# Altium schematic sheet Motorisation.SchDoc
size A4; Author: Audran; CompanyName: Goldorak; Address1: Electrolab; Address2: 52 rue Paul Lescop; Address3: 92000 Nanterre; DocumentNumber: 8; SheetNumber: 8; SheetTotal: 8; ProjectName: Cartes_2017
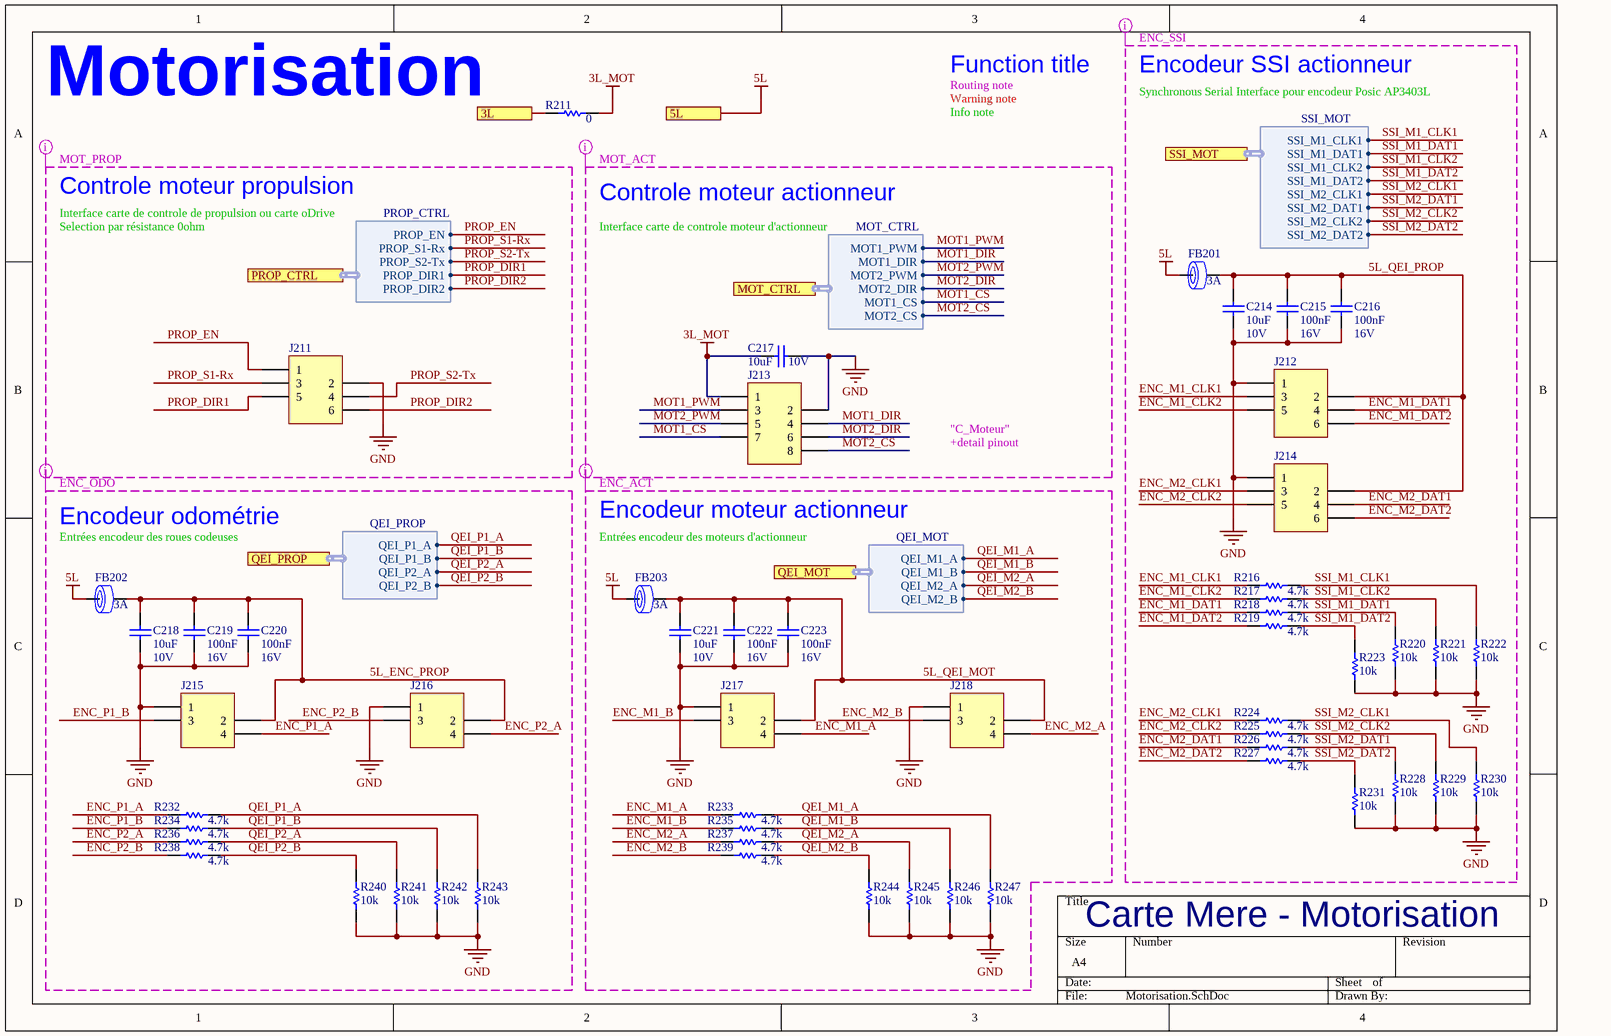
[diagram p0: Motorisation.SchDoc]

## Parts
C214  10uF  RatedVoltage: 10V  [WCAP-CSGP_0805, 2x1.25x1.25]
C215  100nF  RatedVoltage: 16V  [WCAP-CSGP_0402, 1x0.5x0.5]
C216  100nF  RatedVoltage: 16V  [WCAP-CSGP_0402, 1x0.5x0.5]
C217  10uF  RatedVoltage: 10V  [WCAP-CSGP_0805, 2x1.25x1.25]
C218  10uF  RatedVoltage: 10V  [WCAP-CSGP_0805, 2x1.25x1.25]
C219  100nF  RatedVoltage: 16V  [WCAP-CSGP_0402, 1x0.5x0.5]
C220  100nF  RatedVoltage: 16V  [WCAP-CSGP_0402, 1x0.5x0.5]
C221  10uF  RatedVoltage: 10V  [WCAP-CSGP_0805, 2x1.25x1.25]
C222  100nF  RatedVoltage: 16V  [WCAP-CSGP_0402, 1x0.5x0.5]
C223  100nF  RatedVoltage: 16V  [WCAP-CSGP_0402, 1x0.5x0.5]
FB201  RatedCurrent: 3A  [WE-CBF_0805_High Current]  (hidden comment: 742792023)
FB202  RatedCurrent: 3A  [WE-CBF_0805_High Current]  (hidden comment: 742792023)
FB203  RatedCurrent: 3A  [WE-CBF_0805_High Current]  (hidden comment: 742792023)
J211  690367280676  [690367280676]  (value not drawn)
J212  690367280676  [690367280676]  (value not drawn)
J213  690367280876  [690367280876]  (value not drawn)
J214  690367280676  [690367280676]  (value not drawn)
J215  690367280476  [690367280476]  (value not drawn)
J216  690367280476  [690367280476]  (value not drawn)
J217  690367280476  [690367280476]  (value not drawn)
J218  690367280476  [690367280476]  (value not drawn)
R211  value 0  [RESC1608X06N]  (hidden comment: RC0603FR-070RL)
R216  value 4.7k  [RESC1005X04N]  (hidden comment: RC0402FR-074K7L)
R217  value 4.7k  [RESC1005X04N]  (hidden comment: RC0402FR-074K7L)
R218  value 4.7k  [RESC1005X04N]  (hidden comment: RC0402FR-074K7L)
R219  value 4.7k  [RESC1005X04N]  (hidden comment: RC0402FR-074K7L)
R220  value 10k  [RESC1005X04N]  (hidden comment: RC0402FR-0710KL)
R221  value 10k  [RESC1005X04N]  (hidden comment: RC0402FR-0710KL)
R222  value 10k  [RESC1005X04N]  (hidden comment: RC0402FR-0710KL)
R223  value 10k  [RESC1005X04N]  (hidden comment: RC0402FR-0710KL)
R224  value 4.7k  [RESC1005X04N]  (hidden comment: RC0402FR-074K7L)
R225  value 4.7k  [RESC1005X04N]  (hidden comment: RC0402FR-074K7L)
R226  value 4.7k  [RESC1005X04N]  (hidden comment: RC0402FR-074K7L)
R227  value 4.7k  [RESC1005X04N]  (hidden comment: RC0402FR-074K7L)
R228  value 10k  [RESC1005X04N]  (hidden comment: RC0402FR-0710KL)
R229  value 10k  [RESC1005X04N]  (hidden comment: RC0402FR-0710KL)
R230  value 10k  [RESC1005X04N]  (hidden comment: RC0402FR-0710KL)
R231  value 10k  [RESC1005X04N]  (hidden comment: RC0402FR-0710KL)
R232  value 4.7k  [RESC1005X04N]  (hidden comment: RC0402FR-074K7L)
R233  value 4.7k  [RESC1005X04N]  (hidden comment: RC0402FR-074K7L)
R234  value 4.7k  [RESC1005X04N]  (hidden comment: RC0402FR-074K7L)
R235  value 4.7k  [RESC1005X04N]  (hidden comment: RC0402FR-074K7L)
R236  value 4.7k  [RESC1005X04N]  (hidden comment: RC0402FR-074K7L)
R237  value 4.7k  [RESC1005X04N]  (hidden comment: RC0402FR-074K7L)
R238  value 4.7k  [RESC1005X04N]  (hidden comment: RC0402FR-074K7L)
R239  value 4.7k  [RESC1005X04N]  (hidden comment: RC0402FR-074K7L)
R240  value 10k  [RESC1005X04N]  (hidden comment: RC0402FR-0710KL)
R241  value 10k  [RESC1005X04N]  (hidden comment: RC0402FR-0710KL)
R242  value 10k  [RESC1005X04N]  (hidden comment: RC0402FR-0710KL)
R243  value 10k  [RESC1005X04N]  (hidden comment: RC0402FR-0710KL)
R244  value 10k  [RESC1005X04N]  (hidden comment: RC0402FR-0710KL)
R245  value 10k  [RESC1005X04N]  (hidden comment: RC0402FR-0710KL)
R246  value 10k  [RESC1005X04N]  (hidden comment: RC0402FR-0710KL)
R247  value 10k  [RESC1005X04N]  (hidden comment: RC0402FR-0710KL)

## Ports
3L, 5L, MOT_CTRL (harness MOT_CTRL), PROP_CTRL (harness PROP_CTRL), QEI_MOT (harness QEI_MOT), QEI_PROP (harness QEI_PROP), SSI_MOT (harness SSI_MOT)

## Harnesses
PROP_CTRL: PROP_EN, PROP_S1-Rx, PROP_S2-Tx, PROP_DIR1, PROP_DIR2
QEI_PROP: QEI_P1_A, QEI_P1_B, QEI_P2_A, QEI_P2_B
QEI_MOT: QEI_M1_A, QEI_M1_B, QEI_M2_A, QEI_M2_B
SSI_MOT: SSI_M1_CLK1, SSI_M1_DAT1, SSI_M1_CLK2, SSI_M1_DAT2, SSI_M2_CLK1, SSI_M2_DAT1, SSI_M2_CLK2, SSI_M2_DAT2
MOT_CTRL: MOT1_PWM, MOT1_DIR, MOT2_PWM, MOT2_DIR, MOT1_CS, MOT2_CS

## Nets
3L_MOT: C217.1 J213.1 R211.2
5L: FB201.1 FB202.1 FB203.1 ; port 5L
GND: C214.2 C215.2 C216.2 C217.2 C218.2 C219.2 C220.2 C221.2 C222.2 C223.2 J211.2 J212.1 J213.2 J214.1 J215.1 J216.1 J217.1 J218.1 R220.1 R221.1 R222.1 R223.1 R228.1 R229.1 R230.1 R231.1 R240.1 R241.1 R242.1 R243.1 R244.1 R245.1 R246.1 R247.1
3L: R211.1 ; port 3L
5L_ENC_PROP: C218.1 C219.1 C220.1 FB202.2 J215.2 J216.2
5L_QEI_MOT: C221.1 C222.1 C223.1 FB203.2 J217.2 J218.2
5L_QEI_PROP: C214.1 C215.1 C216.1 FB201.2 J212.2 J214.2
ENC_M1_A: J217.4 R233.1
ENC_M1_B: J217.3 R235.1
ENC_M1_CLK1: J212.3 R216.1
ENC_M1_CLK2: J212.5 R217.1
ENC_M1_DAT1: J212.4 R218.1
ENC_M1_DAT2: J212.6 R219.1
ENC_M2_A: J218.4 R237.1
ENC_M2_B: J218.3 R239.1
ENC_M2_CLK1: J214.3 R224.1
ENC_M2_CLK2: J214.5 R225.1
ENC_M2_DAT1: J214.4 R226.1
ENC_M2_DAT2: J214.6 R227.1
ENC_P1_A: J215.4 R232.1
ENC_P1_B: J215.3 R234.1
ENC_P2_A: J216.4 R236.1
ENC_P2_B: J216.3 R238.1
MOT1_CS: J213.7 ; port MOT_CTRL.MOT1_CS
MOT1_DIR: J213.4 ; port MOT_CTRL.MOT1_DIR
MOT1_PWM: J213.3 ; port MOT_CTRL.MOT1_PWM
MOT2_CS: J213.8 ; port MOT_CTRL.MOT2_CS
MOT2_DIR: J213.6 ; port MOT_CTRL.MOT2_DIR
MOT2_PWM: J213.5 ; port MOT_CTRL.MOT2_PWM
PROP_DIR1: J211.5 ; port PROP_CTRL.PROP_DIR1
PROP_DIR2: J211.6 ; port PROP_CTRL.PROP_DIR2
PROP_EN: J211.1 ; port PROP_CTRL.PROP_EN
PROP_S1-Rx: J211.3 ; port PROP_CTRL.PROP_S1-Rx
PROP_S2-Tx: J211.4 ; port PROP_CTRL.PROP_S2-Tx
QEI_M1_A: R233.2 R247.2 ; port QEI_MOT.QEI_M1_A
QEI_M1_B: R235.2 R246.2 ; port QEI_MOT.QEI_M1_B
QEI_M2_A: R237.2 R245.2 ; port QEI_MOT.QEI_M2_A
QEI_M2_B: R239.2 R244.2 ; port QEI_MOT.QEI_M2_B
QEI_P1_A: R232.2 R243.2 ; port QEI_PROP.QEI_P1_A
QEI_P1_B: R234.2 R242.2 ; port QEI_PROP.QEI_P1_B
QEI_P2_A: R236.2 R241.2 ; port QEI_PROP.QEI_P2_A
QEI_P2_B: R238.2 R240.2 ; port QEI_PROP.QEI_P2_B
SSI_M1_CLK1: R216.2 R222.2 ; port SSI_MOT.SSI_M1_CLK1
SSI_M1_CLK2: R217.2 R221.2 ; port SSI_MOT.SSI_M1_CLK2
SSI_M1_DAT1: R218.2 R220.2 ; port SSI_MOT.SSI_M1_DAT1
SSI_M1_DAT2: R219.2 R223.2 ; port SSI_MOT.SSI_M1_DAT2
SSI_M2_CLK1: R224.2 R230.2 ; port SSI_MOT.SSI_M2_CLK1
SSI_M2_CLK2: R225.2 R229.2 ; port SSI_MOT.SSI_M2_CLK2
SSI_M2_DAT1: R226.2 R228.2 ; port SSI_MOT.SSI_M2_DAT1
SSI_M2_DAT2: R227.2 R231.2 ; port SSI_MOT.SSI_M2_DAT2

## Layout directives
net class MOT_PROP: GND, PROP_DIR1, PROP_DIR2, PROP_EN, PROP_S1-Rx, PROP_S2-Tx
net class MOT_ACT: 3L_MOT, GND, MOT1_CS, MOT1_DIR, MOT1_PWM, MOT2_CS, MOT2_DIR, MOT2_PWM
net class ENC_ODO: 5L, 5L_ENC_PROP, ENC_P1_A, ENC_P1_B, ENC_P2_A, ENC_P2_B, GND, QEI_P1_A, QEI_P1_B, QEI_P2_A, QEI_P2_B
net class ENC_SSI: 5L, 5L_QEI_PROP, ENC_M1_CLK1, ENC_M1_CLK2, ENC_M1_DAT1, ENC_M1_DAT2, ENC_M2_CLK1, ENC_M2_CLK2, ENC_M2_DAT1, ENC_M2_DAT2, GND, SSI_M1_CLK1, SSI_M1_CLK2, SSI_M1_DAT1, SSI_M1_DAT2, SSI_M2_CLK1, SSI_M2_CLK2, SSI_M2_DAT1, SSI_M2_DAT2
net class ENC_ACT: 5L, 5L_QEI_MOT, ENC_M1_A, ENC_M1_B, ENC_M2_A, ENC_M2_B, GND, QEI_M1_A, QEI_M1_B, QEI_M2_A, QEI_M2_B

## Notes on the sheet
- Motorisation
- Routing note
- Warning note
- Info note
- Function title
- Encodeur SSI actionneur
- Synchronous Serial Interface pour encodeur Posic AP3403L
- Controle moteur propulsion
- Interface carte de controle de propulsion ou carte oDrive
- Selection par résistance 0ohm
- Controle moteur actionneur
- Interface carte de controle moteur d'actionneur
- "C_Moteur"
- +detail pinout
- Encodeur moteur actionneur
- Encodeur odométrie
- Entrées encodeur des roues codeuses
- Entrées encodeur des moteurs d'actionneur
- Carte Mere - Motorisation

## Library data of the parts
C214 C217 C218 C221 = WCAP-CSGP, 885012207026: CAP CER 10uF 10V X7R 0805; Manufacturer: Wurth Elektronik; ComponentLink1Description: Datasheet; ComponentLink1URL: http://katalog.we-online.com/pbs/datasheet/885012207026.pdf; Manufacturer Part Number: 885012207026; Value: 10uF; Size: 0805; CeramicType: X7R; Supplier 1: Farnell; Supplier Part Number 1: 2495189; Supplier Part Number 2: C15850; Supplier 2: JLCPCB; Supplier Footprint 2: 0805
C215 C216 C219 C220 C222 C223 = WCAP-CSGP, 885012205037: CAP CER 100nF 16V X7R 0402; Manufacturer: Wurth Elektronik; ComponentLink1Description: Datasheet; ComponentLink1URL: http://katalog.we-online.com/pbs/datasheet/885012205037.pdf; Manufacturer Part Number: 885012205037; Value: 100nF; Size: 0402; CeramicType: X7R; Supplier 2: JLCPCB; Supplier Part Number 2: C1525; Supplier Footprint 2: 0402
FB201-FB203 = WE-CBF, 742792023: Ferrite Bead 120ohm 0805 3A; Manufacturer: Wurth Elektronik; Value: 120; ComponentLink1Description: Manufacturer; ComponentLink1URL: https://www.we-online.com/catalog/en/WE-CBF/?sq=742792023#742792023; ComponentLink2Description: Datasheet; ComponentLink2URL: https://www.we-online.com/catalog/datasheet/742792023.pdf; Manufacturer Part Number: 742792023; Supplier 2: JLCPCB; Supplier Part Number 2: C1015; Supplier 1: Farnell; Supplier Part Number 1: 1635732; Supplier Footprint 2: 0805
J211 J212 J214 = 690367280676: WR-MM 6p Female SMT Connector with Polarization; Manufacturer: Wurth Electronics Inc.; Value: 6; ComponentLink1Description: Datasheet; ComponentLink1URL: http://katalog.we-online.de/em/datasheet/69036728xx76.pdf; Manufacturer Part Number: 690367280676; Supplier 1: Farnell; Supplier Part Number 1: 1641849
J213 = 690367280876: WR-MM 8p Female SMT Connector with Polarization; Manufacturer: Wurth Electronics Inc.; Value: 8; Manufacturer Part Number: 690367280876; ComponentLink1Description: Datasheet; ComponentLink1URL: http://katalog.we-online.de/em/datasheet/69036728xx76.pdf; Supplier 1: Farnell; Supplier Part Number 1: 1641850
J215-J218 = 690367280476: WR-MM 4p Female SMT Connector with Polarization; Manufacturer: Wurth Electronics Inc.; Value: 4; ComponentLink1Description: Datasheet; ComponentLink1URL: http://katalog.we-online.de/em/datasheet/69036728xx76.pdf; Manufacturer Part Number: 690367280476; Supplier 1: Farnell; Supplier Part Number 1: 1641848
R211 = RC0603FR-070RL: RES SMD 0 OHM 1% 1/10W 0603; Manufacturer: Yageo; Power: 100mW; Vmax: 50V; Manufacturer Part Number: RC0603FR-070RL; Type: Thick Film; ComponentLink1Description: Manufacturer; ComponentLink1URL: http://www.yageo.com/NewPortal/_en/index.jsp; ComponentLink2Description: Datasheet; ComponentLink2URL: http://www.farnell.com/datasheets/2167052.pdf; Supplier 1: Farnell; Precision: ±1%; Supplier Part Number 1: 2309106; Supplier 2: JLCPCB; Supplier Part Number 2: C21189; Supplier Footprint 2: 0603
R216-R219 R224-R227 R232-R239 = RC0402FR-074K7L: RES SMD 4K7 OHM 1% 1/16W 0402; Manufacturer: Yageo; Power: 63mW; Vmax: 50V; Type: Thick Film; ComponentLink1Description: Manufacturer; ComponentLink1URL: http://www.yageo.com/NewPortal/_en/index.jsp; ComponentLink2Description: Datasheet; ComponentLink2URL: http://www.farnell.com/datasheets/2167052.pdf; Manufacturer Part Number: RC0402FR-074K7L; Supplier 1: Farnell; Supplier Part Number 1: 9239316; Precision: ±1%; Supplier 2: JLCPCB; Supplier Part Number 2: C25900; Supplier Footprint 2: 0402
R220-R223 R228-R231 R240-R247 = RC0402FR-0710KL: RES SMD 10K OHM 1% 1/16W 0402; Manufacturer: Yageo; Power: 63mW; Vmax: 50V; Type: Thick Film; ComponentLink1Description: Manufacturer; ComponentLink1URL: http://www.yageo.com/NewPortal/_en/index.jsp; ComponentLink2Description: Datasheet; ComponentLink2URL: http://www.farnell.com/datasheets/2167052.pdf; Supplier 1: Farnell; Supplier Part Number 1: 9239359; Manufacturer Part Number: RC0402FR-0710KL; Precision: ±1%; Supplier 2: JLCPCB; Supplier Part Number 2: C25744; Supplier Footprint 2: 0402